# EAGLE design motor-control-v1 (EAGLE 6.4)
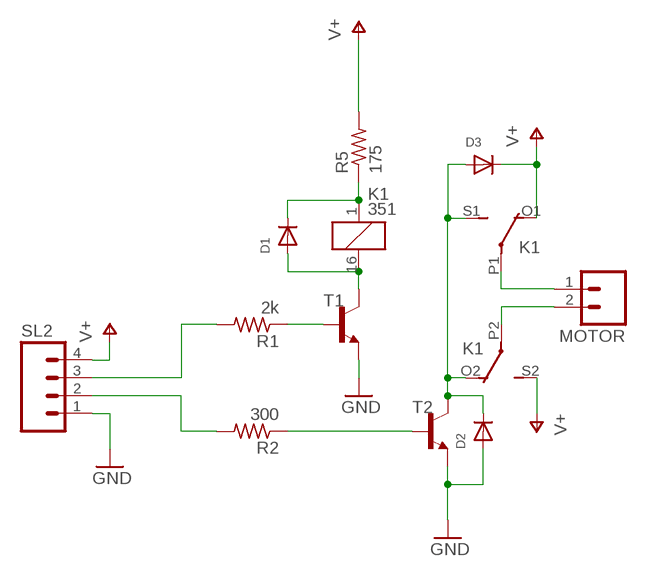
[diagram p0: schematic, sheet 1]

## Parts
D1  DIODESMA  [SMADIODE]
D2  DIODESMA  [SMADIODE]
D3  DIODESMA  [SMADIODE]
K1  351  [351]
MOTOR  M02  [02P]
R1  2k  R-US_R0603  [R0603]
R2  300  R-US_R0603  [R0603]
R5  175  R-US_R0603  [R0603]
SL2  M04  [04P]
T1  BC808-NPN-SOT23-BEC  [SOT23-BEC]
T2  BC808-NPN-SOT23-BEC  [SOT23-BEC]

## Nets
GND: D2.A SL2.1 T1.E T2.E
N$1: R2.2 SL2.2
N$2: R1.2 SL2.3
N$5: K1.P1(2:P) MOTOR.1
N$8: K1.P2(3:P) MOTOR.2
N$9: D2.C D3.A K1.O2(3:O) K1.S1(2:S) T2.C
N$10: D1.A K1.16 T1.C
N$11: D1.C K1.1 R5.1
N$13: R1.1 T1.B
N$14: R2.1 T2.B
V+: D3.C K1.O1(2:O) K1.S2(3:S) R5.2 SL2.4

## Library data of the parts
D1-D3 = adafruit:DIODE: Diode SMADIODE - SMA Surface Mount Package 20V 1A Schottky Diode Digikey: 641-1014-6-ND DO-1N4148 - Through Hole Small Current Diode SOD-123 20V 1 A (.5mV Vf) Schottky Diode - Digikey: MBRX120TPMSCT-ND SOD-323 10V 570mA (.38mV Vf, 3ns) Schottky Diode - Digikey: ZLLS410CT-ND SOD-523 30V 30mA Schottky Diode (RB751S-40TE61) - Digikey: RB751S-40TE61CT-ND SOT23-R/W - SOT23 Package (R = Solder Paste/Reflow Ovens, W = Hand-Soldering) BAT54Film 40V 300mA - Digikey: 497-7162-1-ND
K1 = relay:351: RELAY 2 x switch, Omron; OC_FARNELL: unknown; OC_NEWARK: unknown
MOTOR = con-amp-quick:M02: AMP QUICK CONNECTOR; OC_FARNELL: unknown; OC_NEWARK: unknown
R1 R2 R5 = adafruit:R-US_: RESISTOR, American symbol
SL2 = con-amp-quick:M04: AMP QUICK CONNECTOR; OC_FARNELL: unknown; OC_NEWARK: unknown
T1 T2 = transistor:*-NPN-: NPN Transistror BF959 corrected 2008.03.06

## Board
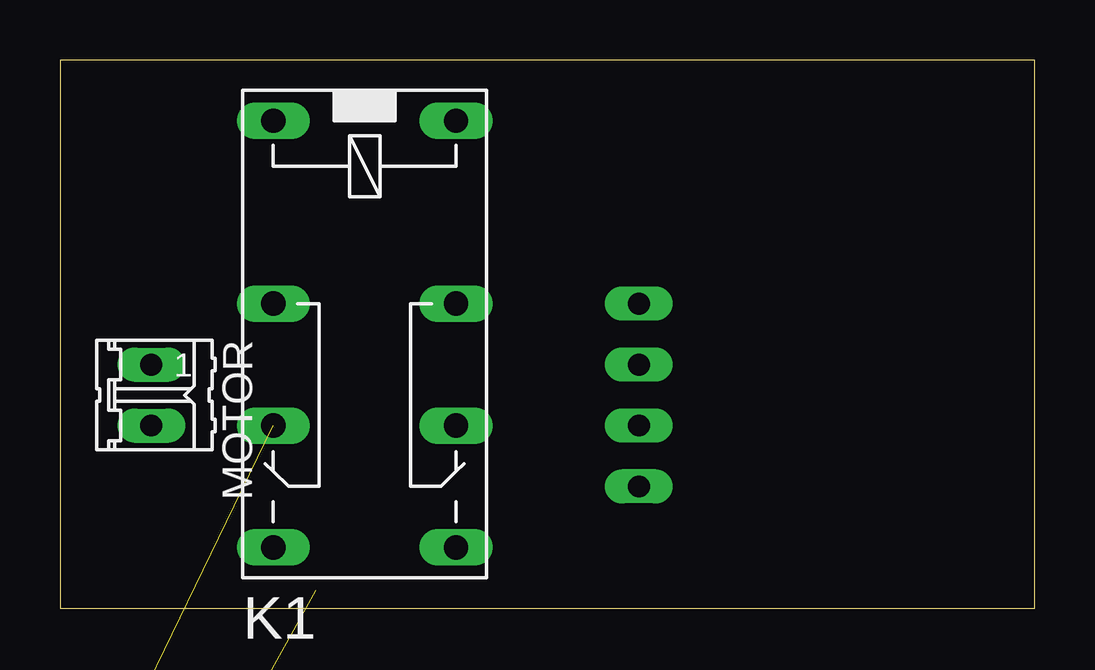
[diagram p1: board, top side]
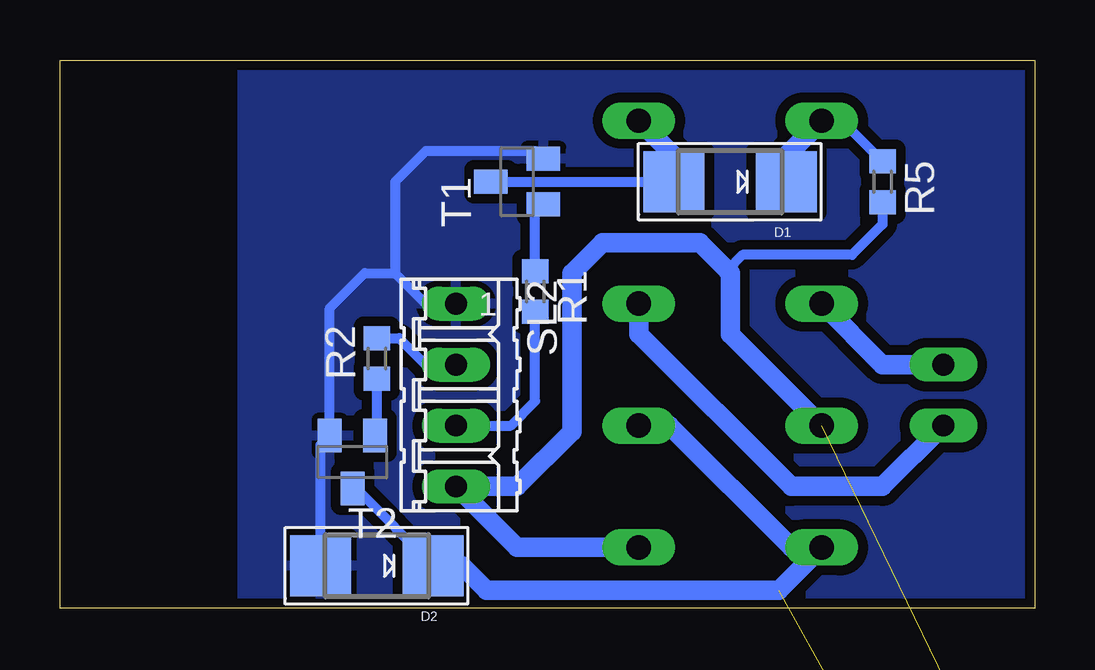
[diagram p2: board, bottom side, seen from below]

Size 40.64 x 22.85 mm. Coordinates in mm from the lower left corner, seen from the top.
Outline: 0,0 40.64,0 40.64,22.85 0,22.85 0,0
Copper layers (1*16): Top 0.035mm / dielectric 1.5mm / Bottom 0.035mm
Design rules "default": minimum track width 10mil, minimum drill 24mil, track to track 16mil, track to pad 16mil, pad to pad 16mil, via to via 16mil, smd to smd 16mil, copper to edge 16mil, drill to drill 8mil, minimum pad ring 10mil, minimum via ring 8mil, stop-mask expansion 4mil, vias tented up to drill 0mil, thermal gap 10mil

### Footprints (pad centres in the part's own frame; a part is rotated, then mirrored left to right if it is on the bottom)
SMADIODE = smd 2.54 x 2.54: A 2.349,0; C -2.349,0
351 = drill 1.016 long: 1 -3.81,-3.81; 16 -3.81,3.81; O1 8.89,-3.81; O2 8.89,3.81; P1 3.81,-3.81; P2 3.81,3.81; S1 13.97,-3.81; S2 13.97,3.81
02P = drill 0.914 long: 1 -1.27,0; 2 1.27,0
R0603 = smd 1 x 1.1: 1 -0.85,0; 2 0.85,0
04P = drill 0.914 long: 1 -3.81,0; 2 -1.27,0; 3 1.27,0; 4 3.81,0
SOT23-BEC = smd 1 x 1.4: B -0.95,-1.1; C 0,1.1; E 0.95,-1.1

### Placement (x,y rotation side)
D1  12.7,17.78 180 bottom
D2  27.43,1.78 180 bottom
D3  5.08,-5.08 0 top  (outside the outline)
K1  12.7,16.51 270 top
MOTOR  3.81,8.89 270 top
R1  20.83,13.21 270 bottom
R2  27.43,10.41 90 bottom
R5  6.35,17.78 270 bottom
SL2  24.13,8.89 270 bottom
T1  21.59,17.78 90 bottom
T2  28.45,6.1 180 bottom

### Tracks (layer width: path | path; a pad name or v marks a point on that pad's centre or on a via)
GND
  Bottom 0.406: SL2.1 25.4,12.7 26.67,13.97 | T1.E 20.51,18.73 20.83,19.05 25.4,19.05 26.67,17.78 26.67,13.97 | D2.A 29.78,6.81 T2.E 29.4,12.51 27.94,13.97 26.67,13.97
  pour Bottom: 0,22.86 0,0 33.02,0 33.02,22.86
N$1
  Bottom 0.406: R2.2 26.5,11.26 25.4,10.16 SL2.2
N$2
  Bottom 0.406: SL2.3 21.84,7.62 20.83,8.64 R1.2
N$5
  Bottom 0.813: MOTOR.1 6.35,10.16 K1.P1
N$8
  Bottom 0.813: K1.P2 16.51,11.43 10.16,5.08 6.35,5.08 MOTOR.2
N$9  (1 unrouted)
  Bottom 0.406: T2.C 28.3,5 D2.C
  Bottom 0.813: K1.O2 15.24,7.62 10.16,2.54 K1.S1 10.67,0.76 22.86,0.76 23.88,1.78 D2.C
N$10
  Bottom 0.406: T1.C D1.A
  Bottom 0.813: D1.A 15.05,18.86 K1.16
N$11
  Bottom 0.406: K1.1 8.04,20.32 R5.1
  Bottom 0.813: D1.C 10.35,18.86 K1.1
N$13
  Bottom 0.406: R1.1 20.83,16.49 T1.B
N$14
  Bottom 0.406: R2.1 27.43,7.26 T2.B
V+  (1 unrouted)
  Bottom 0.406: R5.2 6.35,16 7.62,14.73 12.19,14.73 12.83,14.1
  Bottom 0.813: K1.O1 12.7,11.43 12.7,13.97 12.83,14.1 13.97,15.24 18.03,15.24 19.3,13.97 19.3,7.37 21.59,5.08 SL2.4 21.59,2.54 K1.S2